# EAGLE design nesa-3.0 (EAGLE 6.5.0)
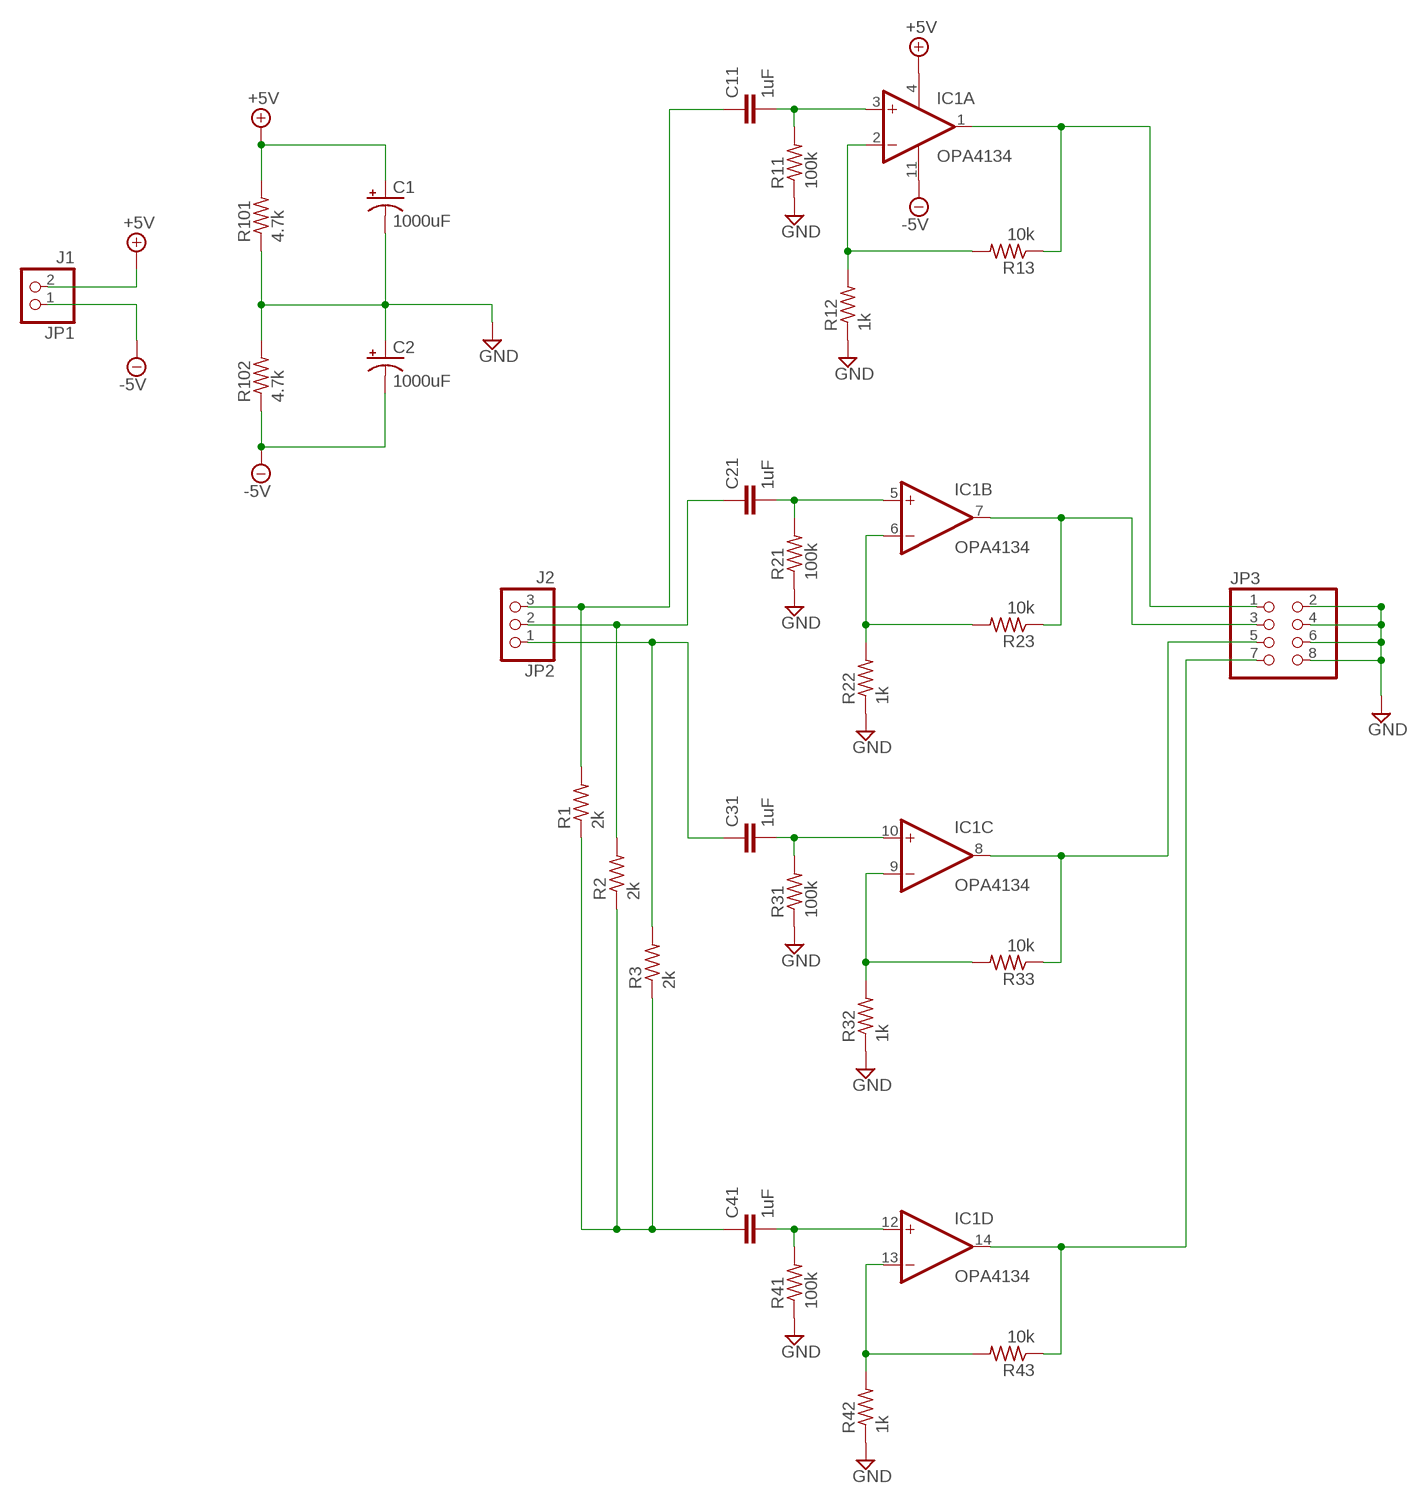
[diagram p0: schematic, sheet 1]

## Parts
C1  1000uF  CPOL-USE3.5-10  [E3,5-10]
C2  1000uF  CPOL-USE3.5-10  [E3,5-10]
C11  1uF  C5/7.2  [C5B7.2]
C21  1uF  C5/7.2  [C5B7.2]
C31  1uF  C5/7.2  [C5B7.2]
C41  1uF  C5/7.2  [C5B7.2]
IC1  OPA4134  MCP604P  [DIL14]
JP1  J1  PINHD-1X2  [1X02]
JP2  J2  PINHD-1X3  [1X03]
JP3  PINHD-2X4  [2X04]
R1  2k  R-US_0204/7  [0204/7]
R2  2k  R-US_0204/7  [0204/7]
R3  2k  R-US_0204/7  [0204/7]
R11  100k  R-US_0204/7  [0204/7]
R12  1k  R-US_0204/7  [0204/7]
R13  10k  R-US_0204/7  [0204/7]
R21  100k  R-US_0204/7  [0204/7]
R22  1k  R-US_0204/7  [0204/7]
R23  10k  R-US_0204/7  [0204/7]
R31  100k  R-US_0204/7  [0204/7]
R32  1k  R-US_0204/7  [0204/7]
R33  10k  R-US_0204/7  [0204/7]
R41  100k  R-US_0204/7  [0204/7]
R42  1k  R-US_0204/7  [0204/7]
R43  10k  R-US_0204/7  [0204/7]
R101  4.7k  R-US_0204/7  [0204/7]
R102  4.7k  R-US_0204/7  [0204/7]

## Nets
+5V: C1.+ IC1.4(P:V+) JP1.2 R101.2
-5V: C2.- IC1.11(P:V-) JP1.1 R102.1
GND: C1.- C2.+ JP3.2 JP3.4 JP3.6 JP3.8 R11.1 R12.1 R21.1 R22.1 R31.1 R32.1 R41.1 R42.1 R101.1 R102.2
N$1: C11.1 JP2.3 R1.2
N$2: IC1.2(A:-IN) R12.2 R13.2
N$3: C11.2 IC1.3(A:+IN) R11.2
N$4: IC1.1(A:OUT) JP3.1 R13.1
N$5: C21.2 IC1.5(B:+IN) R21.2
N$6: IC1.6(B:-IN) R22.2 R23.2
N$8: C31.2 IC1.10(C:+IN) R31.2
N$9: IC1.9(C:-IN) R32.2 R33.2
N$10: IC1.8(C:OUT) JP3.5 R33.1
N$11: C21.1 JP2.2 R2.2
N$12: C31.1 JP2.1 R3.2
N$13: C41.2 IC1.12(D:+IN) R41.2
N$14: IC1.7(B:OUT) JP3.3 R23.1
N$15: IC1.13(D:-IN) R42.2 R43.2
N$16: IC1.14(D:OUT) JP3.7 R43.1
N$17: C41.1 R1.1 R2.1 R3.1

## Library data of the parts
C1 C2 = resistor:CPOL-US: POLARIZED CAPACITOR, American symbol
C11 C21 C31 C41 = capacitor-wima:C: CAPACITOR naming: grid - package width
IC1 = linear:MCP604: Quad Op Amp 2.7V to 6.0V Single Supply CMOS Source: http://ww1.microchip.com/downloads/en/DeviceDoc/21314g.pdf
JP1 = pinhead:PINHD-1X2: PIN HEADER
JP2 = pinhead:PINHD-1X3: PIN HEADER
JP3 = pinhead:PINHD-2X4: PIN HEADER
R1-R3 R11-R13 R21-R23 R31-R33 R41-R43 R101 R102 = resistor:R-US_: RESISTOR, American symbol

## Board
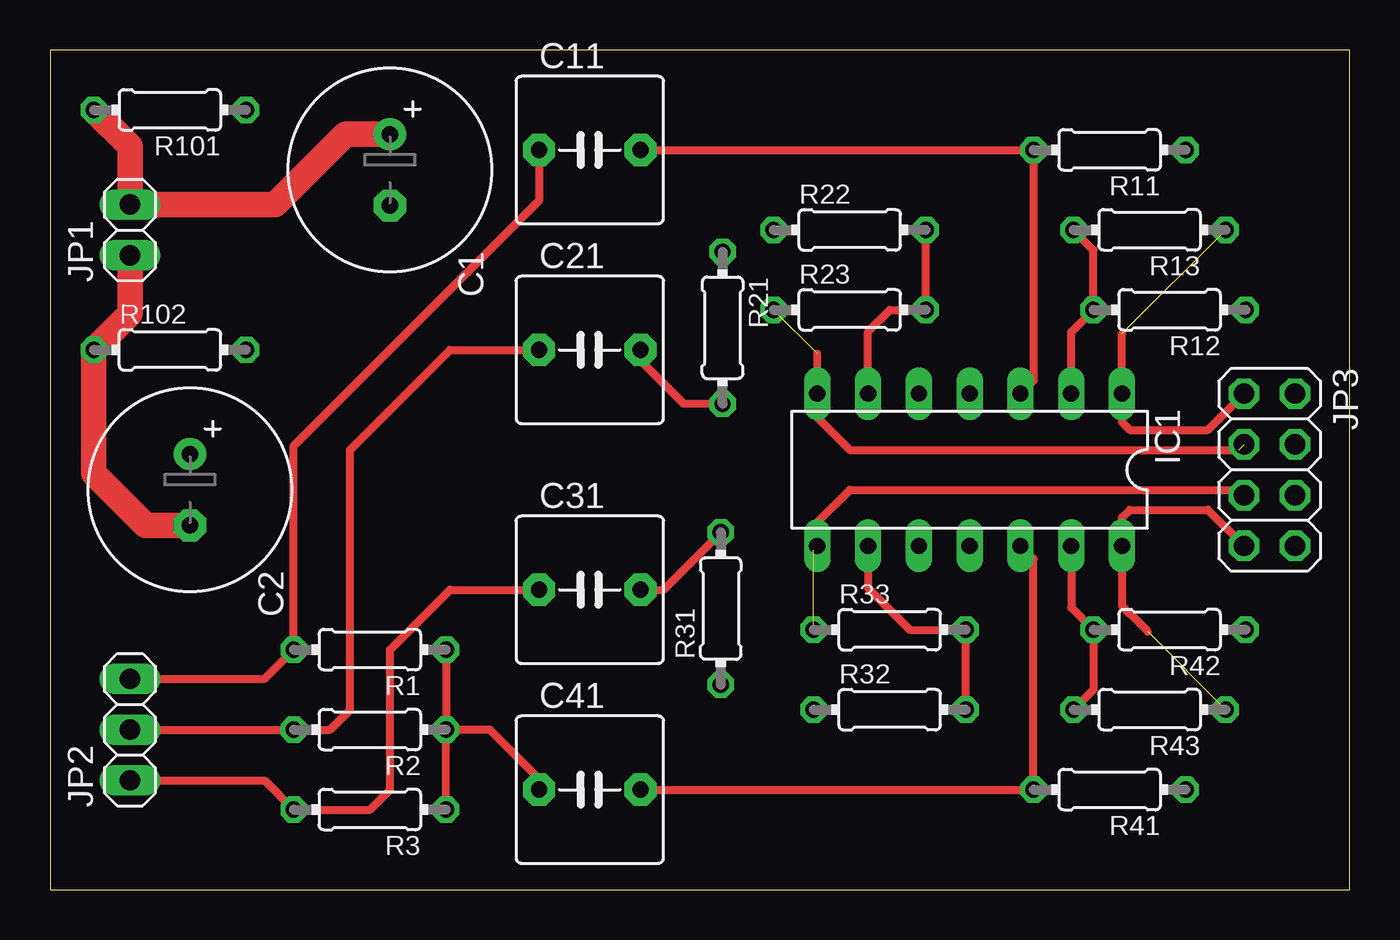
[diagram p1: board, top side]
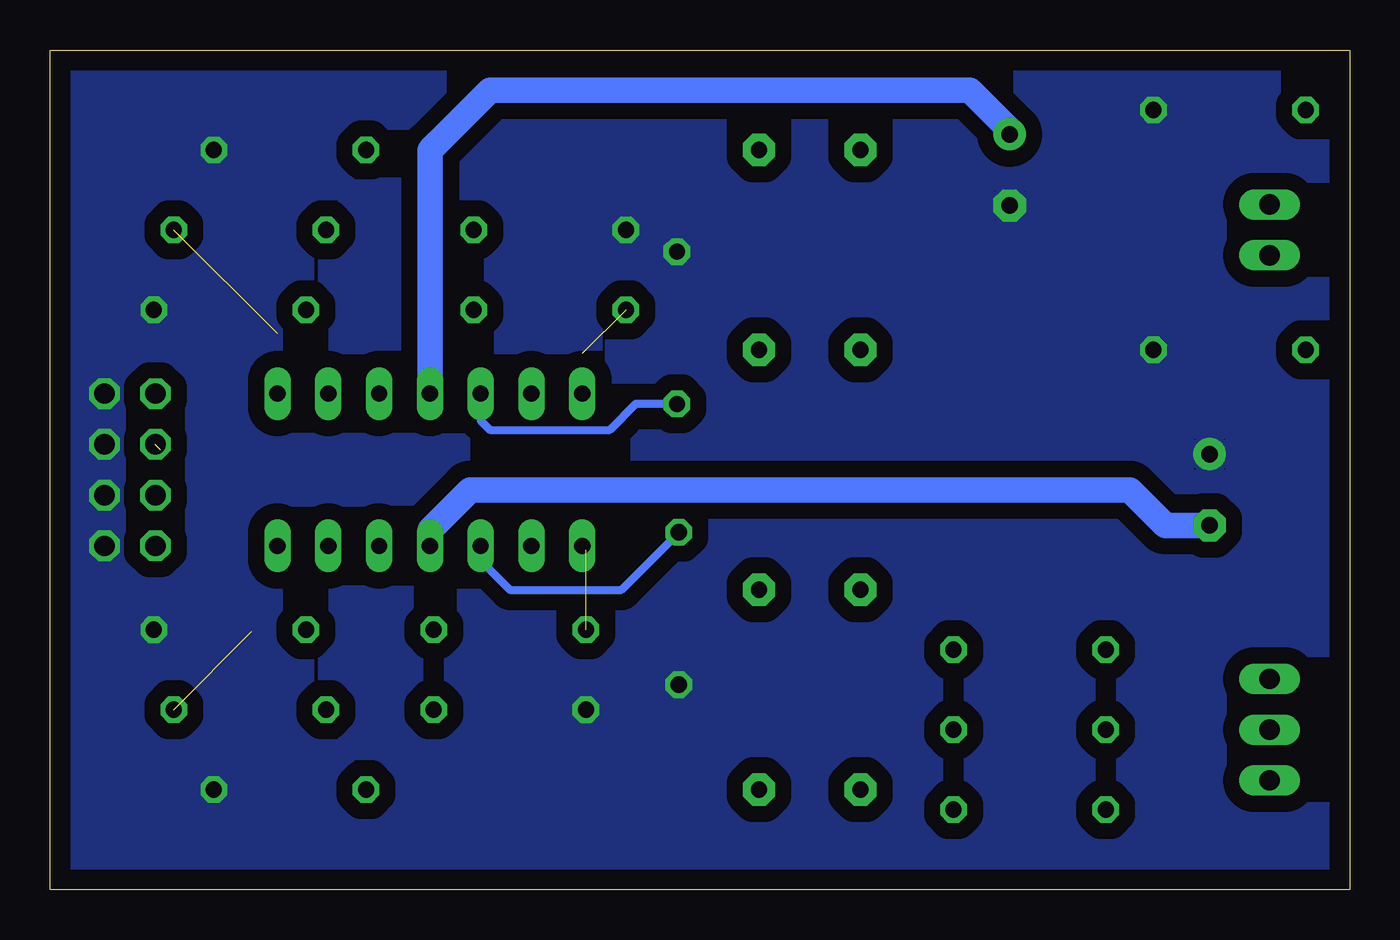
[diagram p2: board, bottom side, seen from below]

Size 65 x 42 mm. Coordinates in mm from the lower left corner, seen from the top.
Outline: 0,0 65,0 65,42 0,42 0,0
Copper layers (1*16): Top 0.035mm / dielectric 1.5mm / Bottom 0.035mm
Design rules "default": minimum track width 10mil, minimum drill 24mil, track to track 8mil, track to pad 8mil, pad to pad 8mil, via to via 8mil, smd to smd 8mil, copper to edge 40mil, drill to drill 8mil, minimum pad ring 10mil, minimum via ring 8mil, stop-mask expansion 4mil, vias tented up to drill 0mil, thermal gap 10mil

### Footprints (pad centres in the part's own frame; a part is rotated, then mirrored left to right if it is on the bottom)
E3,5-10 = drill 0.813 pad 1.6: + -1.778,0 | drill 0.813 pad 1.6 octagon: - 1.778,0
C5B7.2 = drill 0.813 pad 1.6 octagon: 1 -2.54,0; 2 2.54,0
DIL14 = drill 0.813 long: 1 -7.62,-3.81; 2 -5.08,-3.81; 3 -2.54,-3.81; 4 0,-3.81; 5 2.54,-3.81; 6 5.08,-3.81; 7 7.62,-3.81; 8 7.62,3.81; 9 5.08,3.81; 10 2.54,3.81; 11 0,3.81; 12 -2.54,3.81; 13 -5.08,3.81; 14 -7.62,3.81
1X02 = drill 1.016 long: 1 -1.27,0; 2 1.27,0
1X03 = drill 1.016 long: 1 -2.54,0; 2 0,0; 3 2.54,0
2X04 = drill 1.016 octagon: 1 -3.81,-1.27; 2 -3.81,1.27; 3 -1.27,-1.27; 4 -1.27,1.27; 5 1.27,-1.27; 6 1.27,1.27; 7 3.81,-1.27; 8 3.81,1.27
0204/7 = drill 0.813 octagon: 1 -3.81,0; 2 3.81,0

### Placement (x,y rotation side)
C1  17,36 270 top
C2  7,20 270 top
C11  27,37 0 top
C21  27,27 0 top
C31  27,15 0 top
C41  27,5 0 top
IC1  46,21 180 top
JP1  4,33 90 top
JP2  4,8 90 top
JP3  61,21 270 top
R1  16,12 180 top
R2  16,8 180 top
R3  16,4 180 top
R11  53,37 180 top
R12  56,29 180 top
R13  55,33 180 top
R21  33.64,28.1 270 top
R22  40,33 0 top
R23  40,29 0 top
R31  33.55,14.06 90 top
R32  42,9 0 top
R33  42,13 0 top
R41  53,5 180 top
R42  56,13 180 top
R43  55,9 180 top
R101  6,39 180 top
R102  6,27 0 top

### Tracks (layer width: path | path; a pad name or v marks a point on that pad's centre or on a via)
+5V
  Top 1.27: R101.2 4,37.19 JP1.2 11.27,34.27 14.78,37.78 C1.+
  Bottom 1.27: C1.+ 17,38 19,40 43,40 46,37 IC1.4
-5V
  Top 1.27: JP1.1 4,28.81 R102.1 2.19,20.81 4.78,18.22 C2.-
  Bottom 1.27: C2.- 9.22,18.22 11,20 44,20 46,18 IC1.11 46,17
GND
  pour Bottom (isolate 0.813): 0,43 66,43 66,-1 -1,-1 -1,43
N$1
  Top 0.406: JP2.3 10.73,10.54 R1.2 12.19,22.19 24.46,34.46 C11.1
N$2
  Top 0.406: IC1.2 51.08,27.89 R12.2 52.19,32 R13.2
N$3
  Top 0.406: C11.2 R11.2 49.19,25.46 IC1.3
N$4  (1 unrouted)
  Top 0.406: JP3.1 57.92,23 54,23 53.62,23.38 IC1.1 53.62,27.81
N$5
  Top 0.406: C21.2 29.54,26.46 31.71,24.29 R21.2
  Bottom 0.406: R21.2 35.71,24.29 37,23 43,23 43.46,23.46 IC1.5
N$6
  Top 0.406: R22.2 R23.2 42,29 40.92,27.92 IC1.6
N$8
  Top 0.406: C31.2 30.68,15 R31.2
  Bottom 0.406: IC1.10 43.46,16.46 42,15 36.42,15 R31.2
N$9
  Top 0.406: R32.2 R33.2 43,13 40.92,15.08 IC1.9
N$10  (1 unrouted)
  Top 0.406: JP3.5 59.46,20 40,20 38.38,18.38 IC1.8 38.19,17
N$11
  Top 0.406: JP2.2 R2.2 14,8 15,9 15,22 20,27 C21.1
N$12
  Top 0.406: JP2.1 10.73,5.46 R3.2 16,4 17,5 17,12 20,15 C31.1
N$13
  Top 0.406: C41.2 R41.2 49.19,16.54 IC1.12
N$14  (2 unrouted)
  Top 0.406: 38.38,26.81 IC1.7 38.38,23.62 40,22 59.46,22
N$15
  Top 0.406: IC1.13 51.08,14.11 R42.2 52.19,10 R43.2
N$16  (1 unrouted)
  Top 0.406: JP3.7 57.92,19 54,19 53.62,18.62 IC1.14 53.62,14.19 54.5,13.31 54.91,12.9
N$17
  Top 0.406: C41.1 24.46,5.54 22,8 R2.1 | R3.1 R2.1 | R1.1 R2.1